# Altium schematic sheet Current_and_Water_Sensing_System.SchDoc
size A
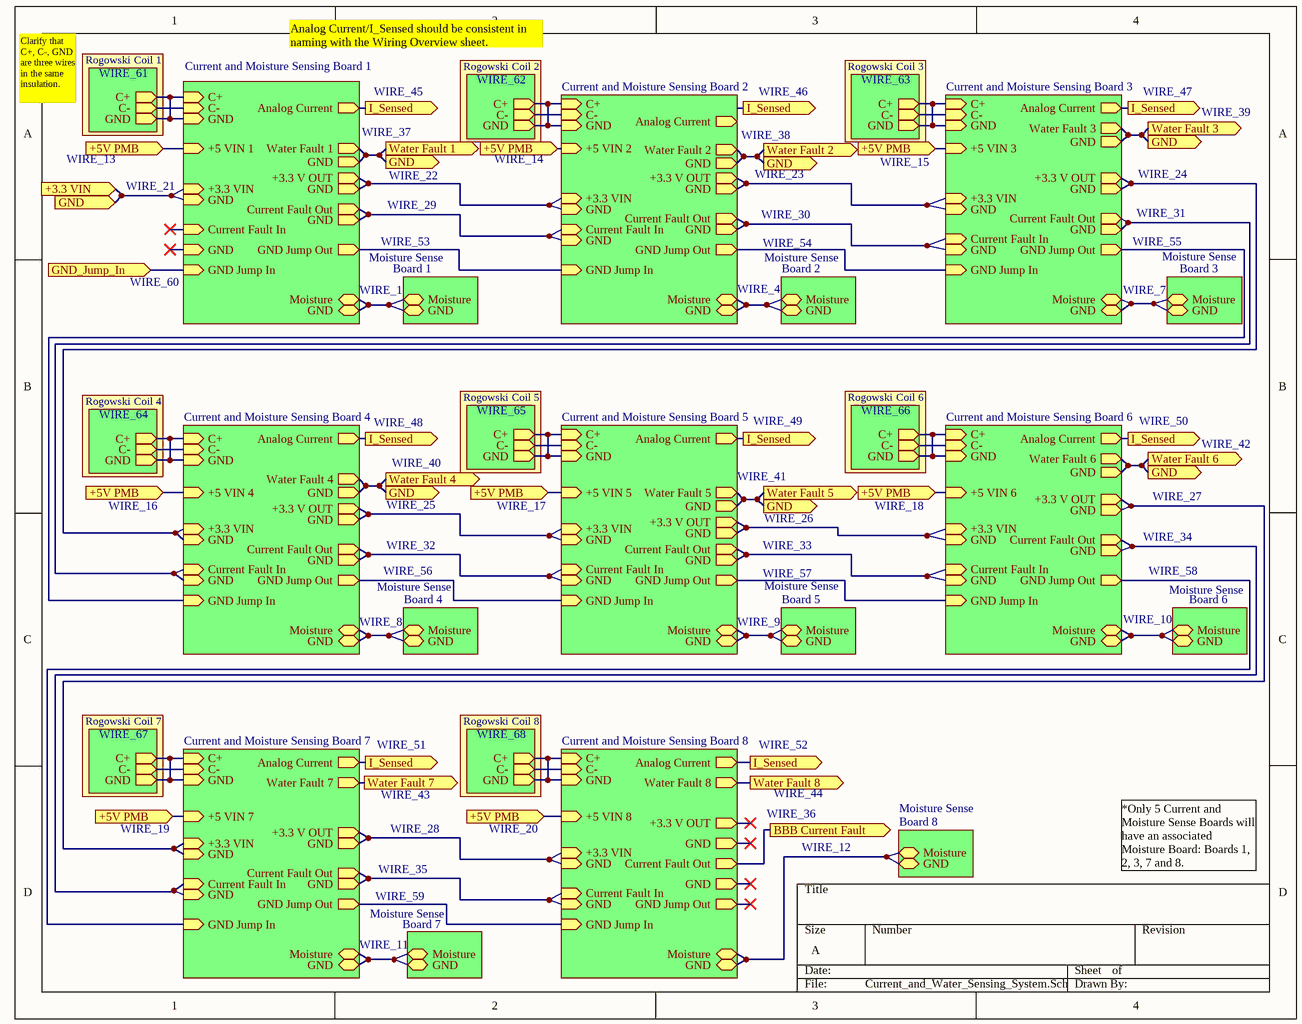
[diagram p0: Current_and_Water_Sensing_System.SchDoc]

## Sub-sheets
Board 1 = File Name: GND (bidir), Moisture (bidir)
Board 2 = File Name: GND (bidir), Moisture (bidir)
Board 3 = File Name: GND (bidir), Moisture (bidir)
Board 4 = File Name: GND (bidir), Moisture (bidir)
Board 5 = File Name: GND (bidir), Moisture (bidir)
Board 6 = File Name: GND (bidir), Moisture (bidir)
Board 7 = File Name: GND (bidir), Moisture (bidir)
Board 8 = File Name: GND (bidir), Moisture (bidir)
Coil 1 = File Name: GND (out), C- (out), C+ (out)
Coil 2 = File Name: GND (out), C- (out), C+ (out)
Coil 3 = File Name: GND (out), C- (out), C+ (out)
Coil 4 = File Name: GND (out), C- (out), C+ (out)
Coil 5 = File Name: GND (out), C- (out), C+ (out)
Coil 6 = File Name: GND (out), C- (out), C+ (out)
Coil 7 = File Name: GND (out), C- (out), C+ (out)
Coil 8 = File Name: GND (out), C- (out), C+ (out)
Current and Moisture Sensing Board 1 = File Name: C- (in), GND (in), Analog Current (out), Water Fault 1 (out), GND (bidir), +3.3 V OUT (out), GND Jump Out (out), +5 VIN 1 (in), +3.3 VIN (in), Current Fault Out (out), Moisture (bidir), Current Fault In (in), GND (in), GND (in), GND (out), GND (out), GND Jump In (in), GND (out), C+ (in)
Current and Moisture Sensing Board 2 = File Name: Analog Current (out), Water Fault 2 (out), GND (bidir), +3.3 V OUT (out), GND Jump Out (out), +5 VIN 2 (in), +3.3 VIN (in), Current Fault Out (out), Moisture (bidir), Current Fault In (in), GND (in), GND (in), GND (out), GND (out), GND Jump In (in), GND (out), C- (in), GND (in), C+ (in)
Current and Moisture Sensing Board 3 = File Name: Analog Current (out), Water Fault 3 (out), GND (bidir), +3.3 V OUT (out), GND Jump Out (out), +5 VIN 3 (in), +3.3 VIN (in), Current Fault Out (out), Moisture (bidir), Current Fault In (in), GND (in), GND (in), GND (out), GND (out), GND Jump In (in), GND (out), C- (in), GND (in), C+ (in)
Current and Moisture Sensing Board 4 = File Name: Analog Current (out), Water Fault 4 (out), GND (bidir), +3.3 V OUT (out), GND Jump Out (out), +5 VIN 4 (in), +3.3 VIN (in), Current Fault Out (out), Moisture (bidir), Current Fault In (in), GND (in), GND (in), GND (out), GND (out), GND Jump In (in), GND (out), C- (in), GND (in), C+ (in)
Current and Moisture Sensing Board 5 = File Name: Analog Current (out), Water Fault 5 (out), GND (bidir), +3.3 V OUT (out), GND Jump Out (out), +5 VIN 5 (in), +3.3 VIN (in), Current Fault Out (out), Moisture (bidir), Current Fault In (in), GND (in), GND (in), GND (out), GND (out), GND Jump In (in), GND (out), C- (in), GND (in), C+ (in)
Current and Moisture Sensing Board 6 = File Name: Analog Current (out), Water Fault 6 (out), GND (bidir), +3.3 V OUT (out), GND Jump Out (out), +5 VIN 6 (in), +3.3 VIN (in), Current Fault Out (out), Moisture (bidir), Current Fault In (in), GND (in), GND (in), GND (out), GND (out), GND Jump In (in), GND (out), C- (in), GND (in), C+ (in)
Current and Moisture Sensing Board 7 = File Name: Analog Current (out), Water Fault 7 (out), +3.3 V OUT (out), GND Jump Out (out), +5 VIN 7 (in), +3.3 VIN (in), Current Fault Out (out), Current Fault In (in), GND (in), GND (in), GND (out), GND (out), GND Jump In (in), Moisture (bidir), GND (bidir), C- (in), GND (in), C+ (in)
Current and Moisture Sensing Board 8 = File Name: Analog Current (out), Water Fault 8 (out), +3.3 V OUT (out), GND Jump Out (out), +5 VIN 8 (in), +3.3 VIN (in), Current Fault Out (out), Current Fault In (in), GND (in), GND (in), GND (out), GND (out), GND Jump In (in), Moisture (bidir), GND (bidir), C- (in), GND (in), C+ (in)

## Ports
+3.3 VIN (in), +5V PMB (in), BBB Current Fault (out), GND (in), GND (out), GND_Jump_In (in), I_Sensed (out), Water Fault 1 (out), Water Fault 2 (out), Water Fault 3 (out), Water Fault 4 (out), Water Fault 5 (out), Water Fault 6 (out), Water Fault 7 (out), Water Fault 8 (out)

## Nets
+3.3 VIN: port Water Fault 1, port Water Fault 4, port Water Fault 2, port Water Fault 5, port Water Fault 3, port Water Fault 6, port +3.3 VIN, port GND, sheet Current and Moisture Sensing Board 2/Water Fault 2, sheet Current and Moisture Sensing Board 2/GND, sheet Current and Moisture Sensing Board 1/Water Fault 1, sheet Current and Moisture Sensing Board 1/+3.3 VIN, sheet Current and Moisture Sensing Board 1/GND, sheet Current and Moisture Sensing Board 1/GND, sheet Current and Moisture Sensing Board 4/Water Fault 4, sheet Current and Moisture Sensing Board 4/GND, sheet Current and Moisture Sensing Board 5/Water Fault 5, sheet Current and Moisture Sensing Board 5/GND, sheet Current and Moisture Sensing Board 6/Water Fault 6, sheet Current and Moisture Sensing Board 6/GND, sheet Current and Moisture Sensing Board 3/Water Fault 3, sheet Current and Moisture Sensing Board 3/GND
+5V PMB: port +5V PMB, sheet Current and Moisture Sensing Board 2/+5 VIN 2, sheet Current and Moisture Sensing Board 1/+5 VIN 1, sheet Current and Moisture Sensing Board 4/+5 VIN 4, sheet Current and Moisture Sensing Board 7/+5 VIN 7, sheet Current and Moisture Sensing Board 5/+5 VIN 5, sheet Current and Moisture Sensing Board 6/+5 VIN 6, sheet Current and Moisture Sensing Board 3/+5 VIN 3, sheet Current and Moisture Sensing Board 8/+5 VIN 8
BBB Current Fault: port BBB Current Fault, sheet Current and Moisture Sensing Board 8/Current Fault Out
GND_Jump_In: port GND_Jump_In, sheet Current and Moisture Sensing Board 1/GND Jump In
I_Sensed: port I_Sensed, sheet Current and Moisture Sensing Board 1/Analog Current, sheet Current and Moisture Sensing Board 4/Analog Current, sheet Current and Moisture Sensing Board 7/Analog Current, sheet Current and Moisture Sensing Board 5/Analog Current, sheet Current and Moisture Sensing Board 6/Analog Current, sheet Current and Moisture Sensing Board 3/Analog Current, sheet Current and Moisture Sensing Board 8/Analog Current
Water Fault 7: port Water Fault 7, sheet Current and Moisture Sensing Board 7/Water Fault 7
Water Fault 8: port Water Fault 8, sheet Current and Moisture Sensing Board 8/Water Fault 8
(unnamed): sheet Current and Moisture Sensing Board 2/GND, sheet Current and Moisture Sensing Board 2/Moisture, sheet Board 2/GND, sheet Board 2/Moisture
(unnamed): sheet Current and Moisture Sensing Board 2/+3.3 V OUT, sheet Current and Moisture Sensing Board 2/GND, sheet Current and Moisture Sensing Board 3/+3.3 VIN, sheet Current and Moisture Sensing Board 3/GND
(unnamed): sheet Current and Moisture Sensing Board 2/GND Jump Out, sheet Current and Moisture Sensing Board 3/GND Jump In
(unnamed): sheet Current and Moisture Sensing Board 2/+3.3 VIN, sheet Current and Moisture Sensing Board 2/GND, sheet Current and Moisture Sensing Board 1/+3.3 V OUT, sheet Current and Moisture Sensing Board 1/GND
(unnamed): sheet Current and Moisture Sensing Board 2/Current Fault Out, sheet Current and Moisture Sensing Board 2/GND, sheet Current and Moisture Sensing Board 3/Current Fault In, sheet Current and Moisture Sensing Board 3/GND
(unnamed): sheet Current and Moisture Sensing Board 2/Current Fault In, sheet Current and Moisture Sensing Board 2/GND, sheet Current and Moisture Sensing Board 1/Current Fault Out, sheet Current and Moisture Sensing Board 1/GND
(unnamed): sheet Current and Moisture Sensing Board 2/GND Jump In, sheet Current and Moisture Sensing Board 1/GND Jump Out
(unnamed): sheet Current and Moisture Sensing Board 2/C-, sheet Coil 2/C-
(unnamed): sheet Current and Moisture Sensing Board 2/GND, sheet Current and Moisture Sensing Board 2/C+, sheet Coil 2/GND, sheet Coil 2/C+
(unnamed): sheet Board 1/GND, sheet Board 1/Moisture, sheet Current and Moisture Sensing Board 1/GND, sheet Current and Moisture Sensing Board 1/Moisture
(unnamed): sheet Current and Moisture Sensing Board 1/C-, sheet Coil 1/C-
(unnamed): sheet Current and Moisture Sensing Board 1/GND, sheet Current and Moisture Sensing Board 1/C+, sheet Coil 1/GND, sheet Coil 1/C+
(unnamed): sheet Current and Moisture Sensing Board 4/GND, sheet Current and Moisture Sensing Board 4/Moisture, sheet Board 4/GND, sheet Board 4/Moisture
(unnamed): sheet Current and Moisture Sensing Board 4/+3.3 V OUT, sheet Current and Moisture Sensing Board 4/GND, sheet Current and Moisture Sensing Board 5/+3.3 VIN, sheet Current and Moisture Sensing Board 5/GND
(unnamed): sheet Current and Moisture Sensing Board 4/GND Jump Out, sheet Current and Moisture Sensing Board 5/GND Jump In
(unnamed): sheet Current and Moisture Sensing Board 4/+3.3 VIN, sheet Current and Moisture Sensing Board 4/GND, sheet Current and Moisture Sensing Board 3/+3.3 V OUT, sheet Current and Moisture Sensing Board 3/GND
(unnamed): sheet Current and Moisture Sensing Board 4/Current Fault Out, sheet Current and Moisture Sensing Board 4/GND, sheet Current and Moisture Sensing Board 5/Current Fault In, sheet Current and Moisture Sensing Board 5/GND
(unnamed): sheet Current and Moisture Sensing Board 4/Current Fault In, sheet Current and Moisture Sensing Board 4/GND, sheet Current and Moisture Sensing Board 3/Current Fault Out, sheet Current and Moisture Sensing Board 3/GND
(unnamed): sheet Current and Moisture Sensing Board 4/GND Jump In, sheet Current and Moisture Sensing Board 3/GND Jump Out
(unnamed): sheet Current and Moisture Sensing Board 4/C-, sheet Coil 4/C-
(unnamed): sheet Current and Moisture Sensing Board 4/GND, sheet Current and Moisture Sensing Board 4/C+, sheet Coil 4/GND, sheet Coil 4/C+
(unnamed): sheet Current and Moisture Sensing Board 7/+3.3 V OUT, sheet Current and Moisture Sensing Board 7/GND, sheet Current and Moisture Sensing Board 8/+3.3 VIN, sheet Current and Moisture Sensing Board 8/GND
(unnamed): sheet Current and Moisture Sensing Board 7/GND Jump Out, sheet Current and Moisture Sensing Board 8/GND Jump In
(unnamed): sheet Current and Moisture Sensing Board 7/+3.3 VIN, sheet Current and Moisture Sensing Board 7/GND, sheet Current and Moisture Sensing Board 6/+3.3 V OUT, sheet Current and Moisture Sensing Board 6/GND
(unnamed): sheet Current and Moisture Sensing Board 7/Current Fault Out, sheet Current and Moisture Sensing Board 7/GND, sheet Current and Moisture Sensing Board 8/Current Fault In, sheet Current and Moisture Sensing Board 8/GND
(unnamed): sheet Current and Moisture Sensing Board 7/Current Fault In, sheet Current and Moisture Sensing Board 7/GND, sheet Current and Moisture Sensing Board 6/Current Fault Out, sheet Current and Moisture Sensing Board 6/GND
(unnamed): sheet Current and Moisture Sensing Board 7/GND Jump In, sheet Current and Moisture Sensing Board 6/GND Jump Out
(unnamed): sheet Current and Moisture Sensing Board 7/Moisture, sheet Current and Moisture Sensing Board 7/GND, sheet Board 7/GND, sheet Board 7/Moisture
(unnamed): sheet Current and Moisture Sensing Board 7/C-, sheet Coil 7/C-
(unnamed): sheet Current and Moisture Sensing Board 7/GND, sheet Current and Moisture Sensing Board 7/C+, sheet Coil 7/GND, sheet Coil 7/C+
(unnamed): sheet Current and Moisture Sensing Board 5/GND, sheet Current and Moisture Sensing Board 5/Moisture, sheet Board 5/GND, sheet Board 5/Moisture
(unnamed): sheet Current and Moisture Sensing Board 5/+3.3 V OUT, sheet Current and Moisture Sensing Board 5/GND, sheet Current and Moisture Sensing Board 6/+3.3 VIN, sheet Current and Moisture Sensing Board 6/GND
(unnamed): sheet Current and Moisture Sensing Board 5/GND Jump Out, sheet Current and Moisture Sensing Board 6/GND Jump In
(unnamed): sheet Current and Moisture Sensing Board 5/Current Fault Out, sheet Current and Moisture Sensing Board 5/GND, sheet Current and Moisture Sensing Board 6/Current Fault In, sheet Current and Moisture Sensing Board 6/GND
(unnamed): sheet Current and Moisture Sensing Board 5/C-, sheet Coil 5/C-
(unnamed): sheet Current and Moisture Sensing Board 5/GND, sheet Current and Moisture Sensing Board 5/C+, sheet Coil 5/GND, sheet Coil 5/C+
(unnamed): sheet Current and Moisture Sensing Board 6/GND, sheet Current and Moisture Sensing Board 6/Moisture, sheet Board 6/GND, sheet Board 6/Moisture
(unnamed): sheet Current and Moisture Sensing Board 6/C-, sheet Coil 6/C-
(unnamed): sheet Current and Moisture Sensing Board 6/GND, sheet Current and Moisture Sensing Board 6/C+, sheet Coil 6/GND, sheet Coil 6/C+
(unnamed): sheet Current and Moisture Sensing Board 3/GND, sheet Current and Moisture Sensing Board 3/Moisture, sheet Board 3/GND, sheet Board 3/Moisture
(unnamed): sheet Current and Moisture Sensing Board 3/C-, sheet Coil 3/C-
(unnamed): sheet Current and Moisture Sensing Board 3/GND, sheet Current and Moisture Sensing Board 3/C+, sheet Coil 3/GND, sheet Coil 3/C+
(unnamed): sheet Current and Moisture Sensing Board 8/Moisture, sheet Current and Moisture Sensing Board 8/GND, sheet Board 8/GND, sheet Board 8/Moisture
(unnamed): sheet Current and Moisture Sensing Board 8/C-, sheet Coil 8/C-
(unnamed): sheet Current and Moisture Sensing Board 8/GND, sheet Current and Moisture Sensing Board 8/C+, sheet Coil 8/GND, sheet Coil 8/C+

## Notes on the sheet
- Clarify that C+, C-, GND are three wires in the same insulation.
- Rogowski
- WIRE_61
- Analog Current/I_Sensed should be consistent in naming with the Wiring Overview sheet.
- WIRE_45
- WIRE_62
- WIRE_46
- WIRE_63
- WIRE_47
- WIRE_13
- WIRE_37
- WIRE_14
- WIRE_38
- WIRE_15
- WIRE_39
- WIRE_21
- WIRE_29
- WIRE_22
- WIRE_23
- WIRE_30
- WIRE_31
- WIRE_24
- WIRE_60
- WIRE_1
- Moisture Sense
- WIRE_53
- WIRE_4
- WIRE_54
- WIRE_7
- WIRE_55
- WIRE_64
- WIRE_48
- WIRE_65
- WIRE_49
- WIRE_66
- WIRE_50
- WIRE_25
- WIRE_40
- WIRE_41
- WIRE_27
- WIRE_42
- WIRE_16
- WIRE_56
- WIRE_32
- WIRE_17
- WIRE_33
- WIRE_26
- WIRE_18
- WIRE_34
- WIRE_58
- WIRE_8
- WIRE_9
- WIRE_57
- WIRE_10
- WIRE_67
- WIRE_51
- WIRE_68
- WIRE_52
- WIRE_19
- WIRE_43
- WIRE_28
- WIRE_20
- WIRE_36
- WIRE_44
- WIRE_59
- WIRE_35
- WIRE_12
- *Only 5 Current and Moisture Sense Boards will have an associated Moisture Board: Boards 1, 2, 3, 7 and 8.
- WIRE_11